# Altium project Task Tyler.PrjPcb (part 2 of 3)

## Sheet LED_POWER.SchDoc
size A; SheetNumber: 27; SheetTotal: 30
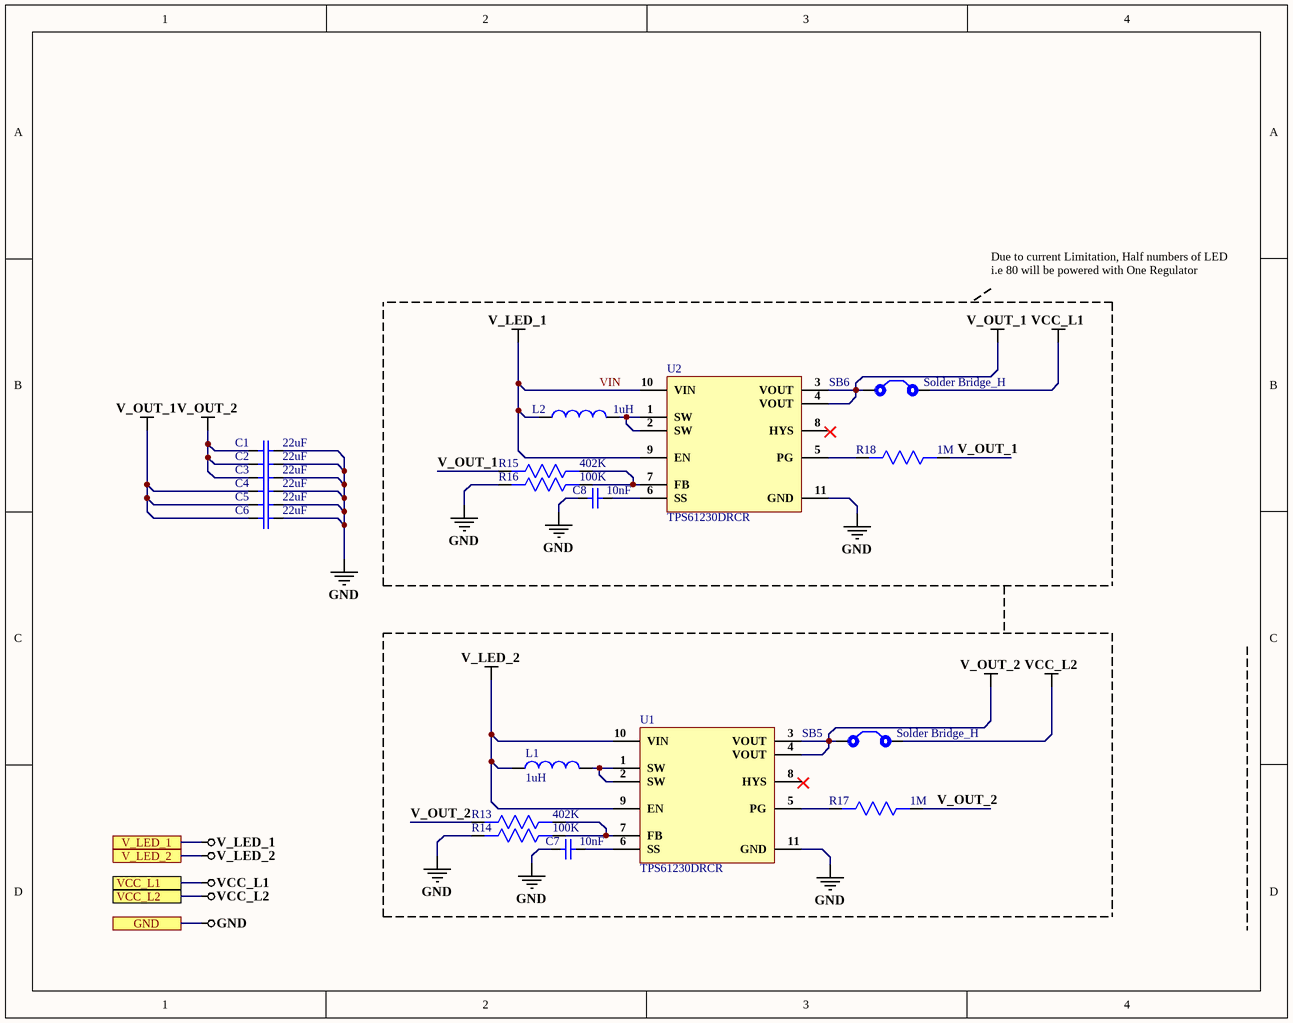
[diagram p23: LED_POWER.SchDoc]

### Parts
C1  22uF  [Cap0805]
C2  22uF  [Cap0805]
C3  22uF  [Cap0805]
C4  22uF  [Cap0805]
C5  22uF  [Cap0805]
C6  22uF  [Cap0805]
C7  10nF  [CAP 0201]
C8  10nF  [CAP 0201]
L1  1uH  [1255AY-1R0N=P3]
L2  1uH  [1255AY-1R0N=P3]
R13  402K  [Res0603]
R14  100K  [Res0402]
R15  402K  [Res0603]
R16  100K  [Res0402]
R17  1M  [Res0402]
R18  1M  [Res0402]
SB5  Solder Bridge_H  [Solder Bridge throgh hole]
SB6  Solder Bridge_H  [Solder Bridge throgh hole]
U1  TPS61230DRCR  [10-VSON (3x3)]
U2  TPS61230DRCR  [10-VSON (3x3)]

### Ports
GND, V_LED_1, V_LED_2, VCC_L1, VCC_L2

### Nets
GND: C1.1 C2.1 C3.1 C4.1 C5.1 C6.1 C7.2 C8.2 R14.2 R16.2 U1.11(GND) U2.11(GND) ; port GND
V_LED_2: L1.2 U1.9(EN) U1.10(VIN) ; port V_LED_2
V_OUT_1: C4.2 C5.2 C6.2 R15.2 R18.1 SB6.1 U2.3(VOUT) U2.4(VOUT)
V_OUT_2: C1.2 C2.2 C3.2 R13.2 R17.1 SB5.1 U1.3(VOUT) U1.4(VOUT)
VCC_L1: SB6.2 ; port VCC_L1
VCC_L2: SB5.2 ; port VCC_L2
VIN: L2.2 U2.9(EN) U2.10(VIN) ; port V_LED_1  [also labelled V_LED_1]
NetC7_1: C7.1 U1.6(SS)
NetC8_1: C8.1 U2.6(SS)
NetL1_1: L1.1 U1.1(SW) U1.2(SW)
NetL2_1: L2.1 U2.1(SW) U2.2(SW)
NetR13_1: R13.1 R14.1 U1.7(FB)
NetR15_1: R15.1 R16.1 U2.7(FB)
NetR17_2: R17.2 U1.5(PG)
NetR18_2: R18.2 U2.5(PG)

Not connected (* = marked no-connect by the designer): U1 8(HYS); U2 8(HYS)

### Notes on the sheet
- Due to current Limitation, Half numbers of LED i.e 80 will be powered with One Regulator

### Library data of the parts
C1-C6 = GRM21BR60J226ME39K: CAP CER 22UF 6.3V X5R 0805; Manufacturer: Murata; Tolerance: 20%; Supplier 1: Digi-Key; Manufacturer Part Number: GRM21BR60J226ME39K; RoHS: Yes; Category: Ceramic Capacitors; Stock 1: 70081; Pricing 1: 1=0.33000, 10=0.22500, 50=0.15020, 100=0.12770, 500=0.09012, 1000=0.07886, 2500=0.07511, 5000=0.06947 (USD); Mount: Surface Mount; Case/Package: 0805; Case Code (Metric): 2012; Case Code (Imperial): 0805; Min Operating Temperature: -55°C; Max Operating Temperature: 85°C; Package Quantity: 1; Capacitance: 22uF; Voltage Rating: 6.3V; Packaging: Tape and Reel; Voltage Rating (DC): 6.3V; Dielectric: X5R; Termination: SMD/SMT; Voltage: 6.3V; Series: GRM; Construction: Flat; Length: 2mm; Width: 0.049inch; Height: 1.25mm; Thickness: 0.053inch; Depth: 1.25mm; Radiation Hardening: No; Lead Free: Lead Free; RoHS Compliant: Yes; ComponentLink1URL: https://datasheet.ciiva.com/6270/partnumbering-e-01-6270375.pdf?src-supplier=Digi-Key; ComponentLink1Description: https://datasheet.ciiva.com/6270/partnumbering-e-01-6270375.pdf?src-supplier=Digi-Key; ComponentLink2URL: https://datasheet.ciiva.com/6270/partnumbering-e-01-6270377.pdf?src-supplier=Digi-Key; ComponentLink2Description: https://datasheet.ciiva.com/6270/partnumbering-e-01-6270377.pdf?src-supplier=Digi-Key; ComponentLink3URL: https://datasheet.ciiva.com/5413/product-5413083.pdf?src-supplier=Mouser; ComponentLink3Description: https://datasheet.ciiva.com/5413/product-5413083.pdf?src-supplier=Mouser; ComponentLink4URL: https://datasheet.ciiva.com/11607/product-11607325.pdf?src-supplier=Avnet; ComponentLink4Description: https://datasheet.ciiva.com/11607/product-11607325.pdf?src-supplier=Avnet; Supplier Part Number 1: 490-6471-1-ND
C7 C8 = GRM033R71C103KE14D: CAP CER 10000PF 16V X7R 0201; Manufacturer: Murata; Tolerance: 10%; Supplier 1: Digi-Key; Manufacturer Part Number: GRM033R71C103KE14D; RoHS: Yes; Category: Ceramic Capacitors; Stock 1: 12651; Pricing 1: 1=0.10000, 10=0.01700, 50=0.00920, 100=0.00750, 500=0.00540, 1000=0.00424, 2500=0.00385, 5000=0.00354 (USD); Voltage Rating (DC): 16V; Dielectric: X7R; Capacitance: 10nF; Length: 600um; Width: 300um; Thickness: 300um; RoHS Compliant: Yes; ComponentLink1URL: http://www.farnell.com/datasheets/2867848.pdf?src-supplier=Farnell; ComponentLink1Description: http://www.farnell.com/datasheets/2867848.pdf?src-supplier=Farnell; ComponentLink2URL: http://search.murata.co.jp/Ceramy/image/img/A01X/G101/ENG/GRM033R71C103KE14-01.pdf?src-supplier=Digi-Key; ComponentLink2Description: http://search.murata.co.jp/Ceramy/image/img/A01X/G101/ENG/GRM033R71C103KE14-01.pdf?src-supplier=Digi-Key; ComponentLink3URL: http://www.farnell.com/datasheets/2867848.pdf?src-supplier=Newark; ComponentLink3Description: http://www.farnell.com/datasheets/2867848.pdf?src-supplier=Newark; ComponentLink4URL: http://www.farnell.com/datasheets/2722745.pdf?src-supplier=Element14; ComponentLink4Description: http://www.farnell.com/datasheets/2722745.pdf?src-supplier=Element14; Supplier Part Number 1: 490-14453-1-ND
L1 L2 = 1255AY-1R0N=P3: FIXED IND 1UH 6.5A 10 MOHM SMD; Manufacturer: Murata; Core Material: Ferrite; Current Rating: 9.5A; Shielding: Shielded; DC Resistance (DCR): 12mR; Test Frequency: 100kHz; Tolerance: 30%; Supplier 1: Digi-Key; Manufacturer Part Number: 1255AY-1R0N=P3; RoHS: Yes; Category: Fixed Inductors; Stock 1: 492; Pricing 1: 1=0.42000, 10=0.36800, 25=0.34120, 50=0.28880, 100=0.26250, 250=0.24676, 500=0.22050 (USD); Mount: Surface Mount; Case/Package: Nonstandard; Packaging: Tape and Reel; Resistor Type: Wirewound; Inductance: 1uH; Max DC Current: 6.5A; Length: 0.248inch; Width: 0.248inch; Height - Seated (Max): 0.177inch; RoHS Compliant: Yes; ComponentLink1URL: http://www.farnell.com/datasheets/2616880.pdf?src-supplier=Farnell; ComponentLink1Description: http://www.farnell.com/datasheets/2616880.pdf?src-supplier=Farnell; ComponentLink2URL: http://search.murata.co.jp/Ceramy/image/img/P02/J(E)TE243B-0037_DG6045C_reference.pdf?src-supplier=Digi-Key; ComponentLink2Description: http://search.murata.co.jp/Ceramy/image/img/P02/J(E)TE243B-0037_DG6045C_reference.pdf?src-supplier=Digi-Key; ComponentLink3URL: http://www.toko.co.jp/products/pdf/inductors/dg6045c.pdf?src-supplier=Digi-Key; ComponentLink3Description: http://www.toko.co.jp/products/pdf/inductors/dg6045c.pdf?src-supplier=Digi-Key; ComponentLink4URL: http://www.toko.co.jp/products/pdf/inductors/dg6045c.pdf?src-supplier=Avnet; ComponentLink4Description: http://www.toko.co.jp/products/pdf/inductors/dg6045c.pdf?src-supplier=Avnet; Supplier Part Number 1: 490-10803-1-ND
R13 R15 = RK73H1JTTD4023F: RES 402K OHM 1% 1/10W 0603; Manufacturer: KOA Speer; Resistance: 402kR; Power Rating: 100mW; Voltage Rating: 50V; Temperature Coefficient: 100ppm/°C; Supplier 1: Digi-Key; Manufacturer Part Number: RK73H1JTTD4023F; RoHS: Yes; Category: Chip SMD Resistors; Stock 1: 50000; Pricing 1: 1=0.10000, 10=0.02200, 100=0.00910, 1000=0.00408, 2500=0.00354 (USD); Case/Package: 0603; Case Code (Imperial): 0603; Case Code (Metric): 1608; Min Operating Temperature: -55°C; Max Operating Temperature: 155°C; Tolerance: 1%; Packaging: Tape and Reel; Resistor Type: Thick Film; Termination: SMD/SMT; Voltage Rating (DC): 50V; Series: RK73H; Construction: Rectangular; Length: 1.6mm; Depth: 0.8mm; Military Standard: Not; Lead Free: Lead Free; RoHS Compliant: Yes; ComponentLink1URL: https://datasheet.ciiva.com/5553/rk73h-5553241.pdf?src-supplier=Mouser; ComponentLink1Description: https://datasheet.ciiva.com/5553/rk73h-5553241.pdf?src-supplier=Mouser; Supplier Part Number 1: 2019-RK73H1JTTD4023FCT-ND
R14 R16 = RK73H1ETTP1003F: RES 100K OHM 1% 1/10W 0402; Manufacturer: KOA Speer; Manufacturer Series: RK73H; Voltage Rating: 50V; Resistance: 100kR; Power Rating: 63mW; Temperature Coefficient: 100ppm/°C; Additional Feature: PRECISION; Supplier 1: Digi-Key; Manufacturer Part Number: RK73H1ETTP1003F; RoHS: Yes; Category: Chip SMD Resistors; Stock 1: 373472; Pricing 1: 1=0.10000, 10=0.02400, 100=0.00970, 1000=0.00437, 2500=0.00380, 5000=0.00314 (USD); Case/Package: 0402; Case Code (Imperial): 0402; Case Code (Metric): 1005; Package Shape: Rectangular; Size Code: 0402; Terminal Finish: Tin; Min Operating Temperature: -55°C; Max Operating Temperature: 155°C; Packaging: Tape and Reel; Package Quantity: 10000; Tolerance: 1%; Resistor Type: Thick Film; Termination: SMD/SMT; Working Voltage: 50V; Voltage Rating (DC): 50V; Series: RK73H; Technology: METAL GLAZE/THICK FILM; Construction: Rectangular; Length: 1mm; Width: 0.5mm; Height: 0.35mm; Depth: 0.5mm; Military Standard: Not; Lead Free: Lead Free; RoHS Compliant: Yes; ComponentLink1URL: http://www.mouser.com/ds/2/219/RK73H-5715.pdf?src-supplier=Mouser; ComponentLink1Description: http://www.mouser.com/ds/2/219/RK73H-5715.pdf?src-supplier=Mouser; ComponentLink2URL: http://www.jameco.com/Jameco/Products/ProdDS/1882455.pdf?src-supplier=Jameco; ComponentLink2Description: http://www.jameco.com/Jameco/Products/ProdDS/1882455.pdf?src-supplier=Jameco; ComponentLink3URL: http://components.arrow.com/part/dataview/39721605S6492599N5146?src-supplier=Arrow+Electronics; ComponentLink3Description: http://components.arrow.com/part/dataview/39721605S6492599N5146?src-supplier=Arrow+Electronics; ComponentLink4URL: https://www.verical.com/server-webapp/html/getDatasheet?partID=26325&src-supplier=Verical; ComponentLink4Description: https://www.verical.com/server-webapp/html/getDatasheet?partID=26325&src-supplier=Verical; Supplier Part Number 1: 2019-RK73H1ETTP1003FCT-ND
R17 R18 = RK73G1ETTP1004F: RES 1M OHM 1% 1/10W 0402; Manufacturer: KOA Speer; Resistance: 4R; Supplier 1: Digi-Key; Manufacturer Part Number: RK73G1ETTP1004F; RoHS: Yes; Category: Chip SMD Resistors; Stock 1: 8474; Pricing 1: 1=0.29000, 10=0.24200, 100=0.09460, 1000=0.03960, 2500=0.03630, 5000=0.03300 (USD); Case/Package: 0402; Case Code (Imperial): 0402; Case Code (Metric): 1005; Packaging: Tape and Reel; Package Quantity: 10000; Termination: SMD/SMT; Series: RK73G; Length: 1mm; Width: 0.5mm; Height: 0.35mm; RoHS Compliant: Yes; ComponentLink1URL: http://www.mouser.com/ds/2/219/RK73G-9863.pdf?src-supplier=Mouser; ComponentLink1Description: http://www.mouser.com/ds/2/219/RK73G-9863.pdf?src-supplier=Mouser; Supplier Part Number 1: 2019-RK73G1ETTP1004FCT-ND
SB5 SB6 = Solder Bridge Trough hole: Solder Bridge ON
U1 U2 = TPS61230DRCR: IC REG BOOST ADJ 4A 10VSON; Manufacturer: Texas Instruments; Number of Outputs: 1; Output Voltage: 5.5V; Max Output Current: 2.1A; Min Input Voltage: 2.3V; Efficiency: 96%; Min Output Voltage: 2.5V; Switching Frequency: 2MHz; Synchronous Rectifier: Yes; Quiescent Current: 35uA; Output Type: Adjustable; Output Configuration: Positive; Supplier 1: Digi-Key; Manufacturer Part Number: TPS61230DRCR; RoHS: Yes; Category: Power Supply Modules; Stock 1: 42459; Pricing 1: 1=2.61000, 10=2.34800, 25=2.21520, 100=1.77230, 250=1.55080, 500=1.50648, 1000=1.19632 (USD); Number of Pins: 10; Weight: 0.001058oz; Contact Plating: Gold; Min Operating Temperature: -40°C; Max Operating Temperature: 85°C; Max Input Voltage: 5.5V; Packaging: Tape and Reel; Max Output Voltage: 5.5V; Output Current: 2.1A; Package Quantity: 3000; Topology: Boost; Operating Supply Voltage: 5.5V; Length: 3.1mm; Width: 3.1mm; Height: 0.95mm; Radiation Hardening: No; REACH SVHC: No SVHC; Lead Free: Lead Free; RoHS Compliant: Yes; ComponentLink1URL: https://datasheet.ciiva.com/48475/tps61230-48475574.pdf?src-supplier=Avnet; ComponentLink1Description: https://datasheet.ciiva.com/48475/tps61230-48475574.pdf?src-supplier=Avnet; Supplier Part Number 1: 296-37761-1-ND

## Sheet POWER_SWITCH.SchDoc
size A; SheetNumber: 29; SheetTotal: 30
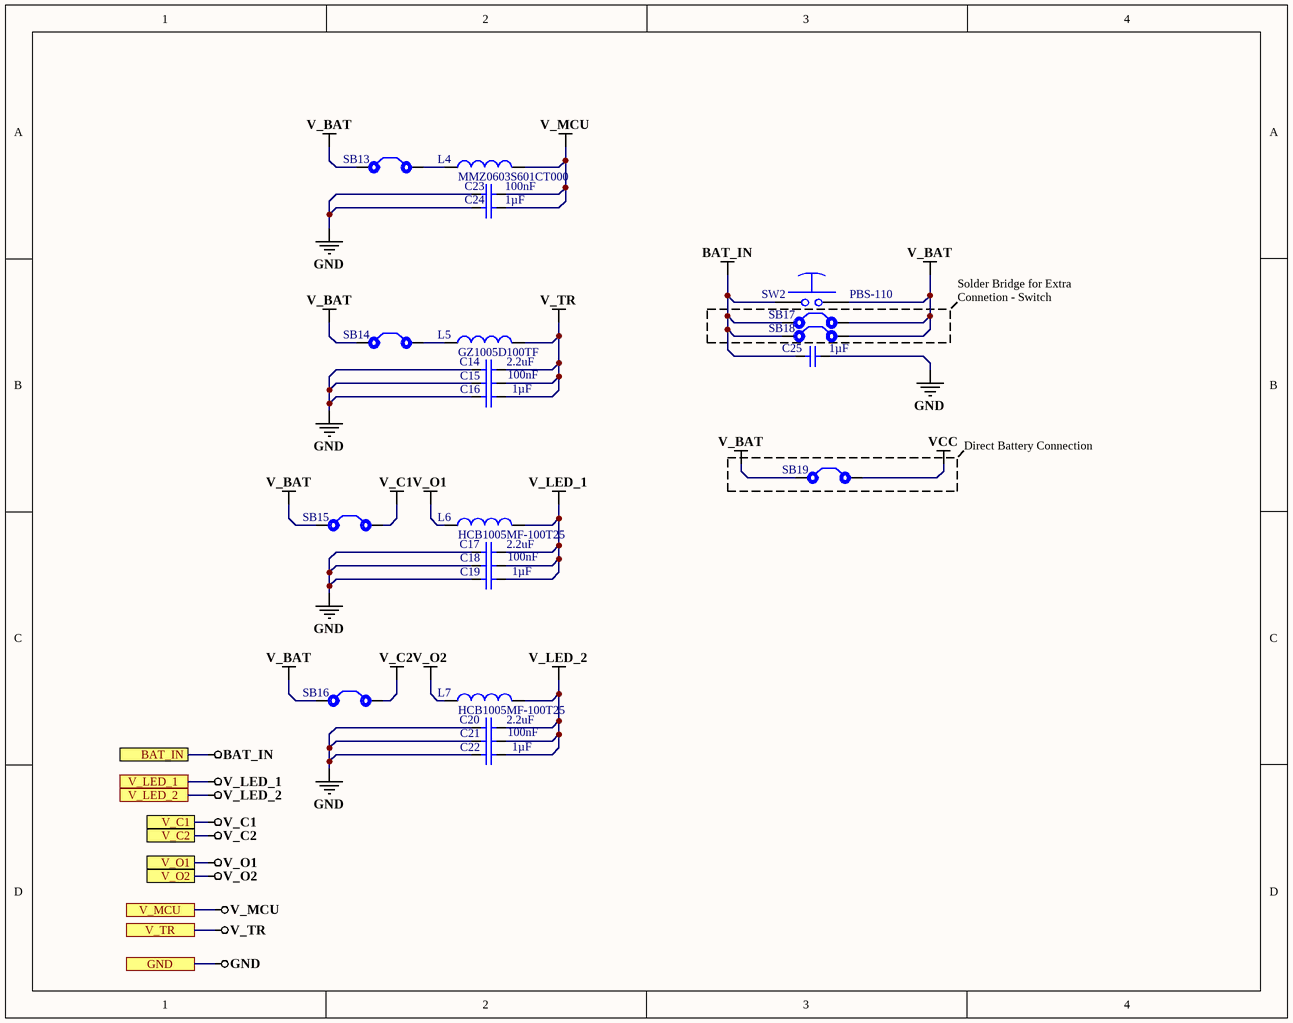
[diagram p24: POWER_SWITCH.SchDoc]

### Parts
C14  2.2uF  [Cap0402]
C15  100nF  [Cap0402]
C16  1µF  [Cap0402]
C17  2.2uF  [Cap0402]
C18  100nF  [Cap0402]
C19  1µF  [Cap0402]
C20  2.2uF  [Cap0402]
C21  100nF  [Cap0402]
C22  1µF  [Cap0402]
C23  100nF  [Cap0402]
C24  1µF  [Cap0402]
C25  1µF  [Cap0402]
L4  MMZ0603S601CT000  [IND 0201]
L5  GZ1005D100TF  [IND 0402 (1005 Metric)]
L6  HCB1005MF-100T25  [HCB1005MF-100T25]
L7  HCB1005MF-100T25  [HCB1005MF-100T25]
SB13  Solder Bridge  [Solder Bridge]  (value not drawn)
SB14  Solder Bridge  [Solder Bridge]  (value not drawn)
SB15  Solder Bridge  [Solder Bridge]  (value not drawn)
SB16  Solder Bridge  [Solder Bridge]  (value not drawn)
SB17  Solder Bridge  [Solder Bridge]  (value not drawn)
SB18  Solder Bridge  [Solder Bridge]  (value not drawn)
SB19  Solder Bridge  [Solder Bridge]  (value not drawn)
SW2  PBS-110  [PBS-110]

### Ports
BAT_IN, GND, V_C1, V_C2, V_LED_1, V_LED_2, V_MCU, V_O1, V_O2, V_TR

### Nets
BAT_IN: C25.2 SB17.1 SB18.1 SW2.1 ; port BAT_IN
GND: C14.2 C15.2 C16.2 C17.2 C18.2 C19.2 C20.2 C21.2 C22.2 C23.2 C24.2 C25.1 ; port GND
V_BAT: SB13.1 SB14.1 SB15.1 SB16.1 SB17.2 SB18.2 SB19.1 SW2.2
V_C1: SB15.2 ; port V_C1
V_C2: SB16.2 ; port V_C2
V_LED_1: C17.1 C18.1 C19.1 L6.2 ; port V_LED_1  [project net VIN]
V_LED_2: C20.1 C21.1 C22.1 L7.2 ; port V_LED_2
V_MCU: C23.1 C24.1 L4.2 ; port V_MCU
V_O1: L6.1 ; port V_O1
V_O2: L7.1 ; port V_O2
V_TR: C14.1 C15.1 C16.1 L5.2 ; port V_TR
VCC: SB19.2
NetL4_1: L4.1 SB13.2
NetL5_1: L5.1 SB14.2

### Notes on the sheet
- Solder Bridge for Extra Connetion - Switch
- Direct Battery Connection

### Library data of the parts
C14 C17 C20 = CL05A225KA5NUNC: CAP CER 2.2UF 25V X5R 0402; Manufacturer: Samsung; Tolerance: 10%; Supplier 1: Digi-Key; Manufacturer Part Number: CL05A225KA5NUNC; RoHS: Yes; Category: Ceramic Capacitors; Stock 1: 10124; Pricing 1: 1=0.35000, 10=0.23700, 50=0.15820, 100=0.13440, 500=0.09488, 1000=0.08302, 2500=0.07907, 5000=0.07314 (USD); Mount: Surface Mount; Case/Package: 0402; Case Code (Metric): 1005; Case Code (Imperial): 0402; Min Operating Temperature: -55°C; Max Operating Temperature: 85°C; Package Quantity: 1; Packaging: Cut Tape; Capacitance: 2.2uF; Voltage Rating: 25V; Length: 0.039inch; Width: 0.02inch; Thickness: 0.022inch; ComponentLink1URL: https://datasheet.ciiva.com/25790/cl05a225ka5nunc-25790835.pdf?src-supplier=Digi-Key; ComponentLink1Description: https://datasheet.ciiva.com/25790/cl05a225ka5nunc-25790835.pdf?src-supplier=Digi-Key; Supplier Part Number 1: 1276-1460-1-ND
C15 C18 C21 C23 = CC0402KRX7R8BB104: CAP CER 0.1UF 25V X7R 0402; Manufacturer: Yageo; Tolerance: 10%; Dissipation Factor: 3.5%; Supplier 1: Digi-Key; Manufacturer Part Number: CC0402KRX7R8BB104; RoHS: Yes; Category: Ceramic Capacitors; Stock 1: 1841009; Pricing 1: 1=0.10000, 10=0.03100, 50=0.01700, 100=0.01390, 500=0.00990, 1000=0.00777, 2500=0.00707, 5000=0.00650 (USD); Mount: Surface Mount; Case/Package: 0402; Case Code (Imperial): 0402; Case Code (Metric): 1005; Min Operating Temperature: -55°C; Max Operating Temperature: 125°C; Capacitance: 100nF; Dielectric: X7R; Voltage Rating: 25V; Voltage Rating (DC): 25V; Packaging: Tape and Reel; Termination: SMD/SMT; Resistor Type: Ceramic; Length: 1mm; Width: 0.02inch; Height: 0.5mm; Thickness: 0.022inch; Depth: 0.5mm; Radiation Hardening: No; Lead Free: Lead Free; Halogen Free: Halogen Free; ComponentLink1URL: https://datasheet.ciiva.com/11464/upy-gphc-x7r-6-3v-to-50v-8-11464889.pdf?src-supplier=Avnet; ComponentLink1Description: https://datasheet.ciiva.com/11464/upy-gphc-x7r-6-3v-to-50v-8-11464889.pdf?src-supplier=Avnet; ComponentLink2URL: https://datasheet.ciiva.com/13210/upy-gphc-x7r-6-3v-to-50v-8-12304-13210908.pdf?src-supplier=Mouser; ComponentLink2Description: https://datasheet.ciiva.com/13210/upy-gphc-x7r-6-3v-to-50v-8-12304-13210908.pdf?src-supplier=Mouser; ComponentLink3URL: https://datasheet.ciiva.com/17437/upy-gphc-x7r-6-3v-to-50v-8-17437357.pdf?src-supplier=Avnet+Europe; ComponentLink3Description: https://datasheet.ciiva.com/17437/upy-gphc-x7r-6-3v-to-50v-8-17437357.pdf?src-supplier=Avnet+Europe; Supplier Part Number 1: 311-2077-1-ND
C16 C19 C22 C24 C25 = GRM155R61E105KA12D: CAP CER 1UF 25V X5R 0402; Manufacturer: Murata; Material: Ceramic; Tolerance: 10%; Supplier 1: Digi-Key; Manufacturer Part Number: GRM155R61E105KA12D; RoHS: Yes; Category: Ceramic Capacitors; Stock 1: 961231; Pricing 1: 1=0.11000, 10=0.08000, 50=0.04360, 100=0.03560, 500=0.02542, 1000=0.01997, 2500=0.01815, 5000=0.01670 (USD); Mount: Surface Mount; Case/Package: 0402; Case Code (Metric): 1005; Case Code (Imperial): 0402; Weight: 0.000212oz; Min Operating Temperature: -55°C; Max Operating Temperature: 85°C; Capacitance: 1uF; Voltage Rating: 25V; Packaging: Tape and Reel; Dielectric: X5R; Voltage: 25V; Termination: SMD/SMT; Voltage Rating (DC): 25V; Package Quantity: 10000; Series: GRM; Length: 1mm; Width: 0.5mm; Height: 0.5mm; Thickness: 0.022inch; Depth: 0.5mm; REACH SVHC: No SVHC; Lead Free: Lead Free; ComponentLink1URL: https://datasheet.ciiva.com/22732/1666664-22732122.pdf?src-supplier=Element14; ComponentLink1Description: https://datasheet.ciiva.com/22732/1666664-22732122.pdf?src-supplier=Element14; ComponentLink2URL: https://datasheet.ciiva.com/7719/1666664-7719006.pdf?src-supplier=Element14; ComponentLink2Description: https://datasheet.ciiva.com/7719/1666664-7719006.pdf?src-supplier=Element14; Supplier Part Number 1: 490-10017-1-ND
L4 = MMZ0603S601CT000: FERRITE BEAD 600 OHM 0201 1LN; Manufacturer: TDK; Impedance: 600R; Tolerance: 25%; DC Resistance (DCR): 1.45R; Max DC Current: 100mA; Supplier 1: Digi-Key; Manufacturer Part Number: MMZ0603S601CT000; RoHS: Yes; Category: Inductors; Stock 1: 1540; Pricing 1: 1=0.12000, 10=0.09900, 25=0.07680, 50=0.06380, 100=0.05500, 250=0.04400, 500=0.03960, 1000=0.03300, 5000=0.03080 (USD); Mount: Surface Mount; Case/Package: 0201; Core Material: Ferrite; Case Code (Metric): 0603; Case Code (Imperial): 0201; Packaging: Cut Tape; Package Quantity: 15000; Current Rating: 100mA; Length: 0.024inch; Width: 0.012inch; Height: 0.013inch; REACH SVHC: No SVHC; Lead Free: Lead Free; RoHS Compliant: Yes; ComponentLink1URL: https://datasheet.ciiva.com/46381/1795294-46381669.pdf?src-supplier=Element14; ComponentLink1Description: https://datasheet.ciiva.com/46381/1795294-46381669.pdf?src-supplier=Element14; ComponentLink2URL: https://datasheet.ciiva.com/46634/beads-commercial-signal-mmz-en-46634390.pdf?src-supplier=Digi-Key; ComponentLink2Description: https://datasheet.ciiva.com/46634/beads-commercial-signal-mmz-en-46634390.pdf?src-supplier=Digi-Key; ComponentLink3URL: https://datasheet.ciiva.com/48682/beads-commercial-signal-mmz-en-48682603.pdf?src-supplier=Avnet; ComponentLink3Description: https://datasheet.ciiva.com/48682/beads-commercial-signal-mmz-en-48682603.pdf?src-supplier=Avnet; ComponentLink4URL: https://datasheet.ciiva.com/46634/beads-commercial-signal-mmz-en-46634381.pdf?src-supplier=Digi-Key; ComponentLink4Description: https://datasheet.ciiva.com/46634/beads-commercial-signal-mmz-en-46634381.pdf?src-supplier=Digi-Key; Supplier Part Number 1: 445-2146-1-ND
L5 = GZ1005D100TF: 10Ω 100MHz 500mA 1 50mΩ 0402 Ferrite Beads; Manufacturer: Sunlord; Value: Custom; Manufacturer Part No: GZ1005D100TF; Package: 0402
L6 L7 = HCB1005MF-100T25: 10Ω 100MHz 2.5A 1 50mΩ 0402 Ferrite Beads; Manufacturer: TAI-TECH; Current Rating (Max): 10Ω @ 100MHz; Number of Lines: 1; Package: 0402; Current Rating (Max): 2.5A; DC Resistance (DCR) (Max): 50mΩ
SB13-SB19 = Solder Bridge: Solder Bridge ON
SW2 = PBS-110: Conn Isolated Power Socket Strip SKT 20 POS 4.19mm Solder ST Thru-Hole 20 Terminal 1 Port Tube; Switch Type: Push Button Switch; Current: 15A; Features: Momentary; Material: Plastic; Model Number: PBS-110

## Sheet SEC_POWER.SchDoc
size A; SheetNumber: 30; SheetTotal: 30
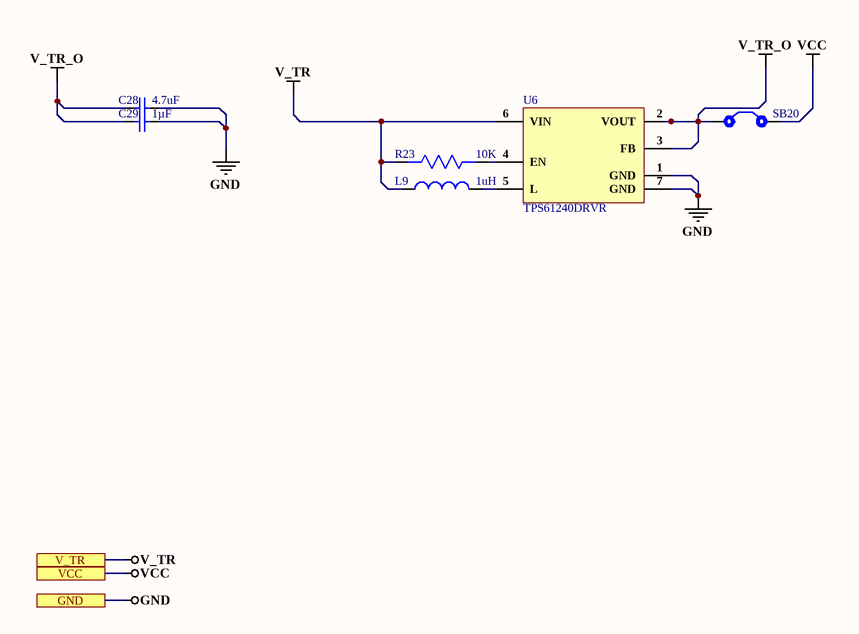
[diagram p25: SEC_POWER.SchDoc]

### Parts
C28  4.7uF  [Cap0402]
C29  1µF  [Cap0402]
L9  1uH  [IND 0603]
R23  10K  [Res-0201]
SB20  Solder Bridge  [Solder Bridge]  (value not drawn)
U6  TPS61240DRVR  [TPS61240DRVR]

### Ports
GND, V_TR, VCC

### Nets
GND: C28.1 C29.1 U6.1(GND) U6.7(GND) ; port GND
V_TR: L9.1 R23.2 U6.6(VIN) ; port V_TR
V_TR_O: C28.2 C29.2 SB20.1 U6.2(VOUT) U6.3(FB)
VCC: SB20.2 ; port VCC
NetL9_2: L9.2 U6.5(L)
NetR23_1: R23.1 U6.4(EN)

### Library data of the parts
C28 = CC0402MRX5R5BB475: CAP CER 4.7UF 6.3V X5R 0402; Manufacturer: Yageo; Tolerance: 20%; Voltage: 4V; Supplier 1: Digi-Key; Manufacturer Part Number: CC0402MRX5R5BB475; RoHS: Yes; Category: Ceramic Capacitors; Stock 1: 47905; Pricing 1: 1=0.18000, 10=0.12400, 50=0.07460, 100=0.06300, 500=0.04308, 1000=0.03810, 2500=0.03644, 5000=0.03313 (USD); Mount: Surface Mount; Case/Package: 0402; Case Code (Imperial): 0402; Case Code (Metric): 1005; Weight: 2.3E-05oz; Min Operating Temperature: -55°C; Max Operating Temperature: 85°C; Capacitance: 4.7uF; Dielectric: X5R; Voltage Rating (DC): 6.3V; Packaging: Tape and Reel; Voltage Rating: 6.3V; Termination: SMD/SMT; Resistor Type: Ceramic; Length: 1mm; Width: 0.02inch; Height: 0.5mm; Thickness: 0.022inch; Depth: 0.5mm; Radiation Hardening: No; Lead Free: Lead Free; Halogen Free: Halogen Free; ComponentLink1URL: http://components.arrow.com/part/dataview/0323_04166410?src-supplier=Arrow+Europe; ComponentLink1Description: http://components.arrow.com/part/dataview/0323_04166410?src-supplier=Arrow+Europe; ComponentLink2URL: http://www.mouser.com/ds/2/447/UPY-GPHC_X5R_4V-to-50V_25-1131599.pdf?src-supplier=Mouser; ComponentLink2Description: http://www.mouser.com/ds/2/447/UPY-GPHC_X5R_4V-to-50V_25-1131599.pdf?src-supplier=Mouser; ComponentLink3URL: http://www.yageo.com/documents/recent/UPY-GPHC_X5R_4V-to-50V_25.pdf?src-supplier=Digi-Key; ComponentLink3Description: http://www.yageo.com/documents/recent/UPY-GPHC_X5R_4V-to-50V_25.pdf?src-supplier=Digi-Key; ComponentLink4URL: http://www.yageo.com/documents/recent/UPY-GPHC_X5R_4V-to-50V_12.pdf?src-supplier=Avnet; ComponentLink4Description: http://www.yageo.com/documents/recent/UPY-GPHC_X5R_4V-to-50V_12.pdf?src-supplier=Avnet; ComponentLink5URL: http://www.yageo.com/documents/recent/UPY-GPHC_X5R_4V-to-50V_12.pdf?src-supplier=Avnet+Europe; ComponentLink5Description: http://www.yageo.com/documents/recent/UPY-GPHC_X5R_4V-to-50V_12.pdf?src-supplier=Avnet+Europe; ComponentLink6URL: http://www.yageo.com/exep/pages/download/literatures/ProductSelectionGuide%202014_Final_2.pdf?src-supplier=Digi-Key; ComponentLink6Description: http://www.yageo.com/exep/pages/download/literatures/ProductSelectionGuide%202014_Final_2.pdf?src-supplier=Digi-Key; Supplier Part Number 1: 311-1730-1-ND
C29 = GRM155R61E105KA12D: as C16 on sheet POWER_SWITCH; Supplier 1: Digi-Key; Manufacturer Part Number: GRM155R61E105KA12D; RoHS: Yes; Category: Ceramic Capacitors; Stock 1: 961231; Pricing 1: 1=0.11000, 10=0.08000, 50=0.04360, 100=0.03560, 500=0.02542, 1000=0.01997, 2500=0.01815, 5000=0.01670 (USD); Mount: Surface Mount; Case/Package: 0402; Case Code (Metric): 1005; Case Code (Imperial): 0402; Weight: 0.000212oz; Min Operating Temperature: -55°C; Max Operating Temperature: 85°C; Capacitance: 1uF; Voltage Rating: 25V; Packaging: Tape and Reel; Dielectric: X5R; Voltage: 25V; Termination: SMD/SMT; Voltage Rating (DC): 25V; Package Quantity: 10000; Series: GRM; Length: 1mm; Width: 0.5mm; Height: 0.5mm; Thickness: 0.022inch; Depth: 0.5mm; REACH SVHC: No SVHC; Lead Free: Lead Free; ComponentLink1URL: https://datasheet.ciiva.com/22732/1666664-22732122.pdf?src-supplier=Element14; ComponentLink1Description: https://datasheet.ciiva.com/22732/1666664-22732122.pdf?src-supplier=Element14; ComponentLink2URL: https://datasheet.ciiva.com/7719/1666664-7719006.pdf?src-supplier=Element14; ComponentLink2Description: https://datasheet.ciiva.com/7719/1666664-7719006.pdf?src-supplier=Element14; Supplier Part Number 1: 490-10017-1-ND
L9 = MGFL1608F1R0MT-LF: 1uH ±20% 1A 180mΩ 0603 Inductors; Manufacturer: microgate; Inductance: 1uH; Tolerance: ±20%; Rated current: 1A; Package: 0603
R23 = RC0201FR-0710KL: RES SMD 10K OHM 1% 1/20W 0201; Manufacturer: Yageo; Temperature Coefficient: 200ppm/°C; Resistance: 10kR; Max Power Dissipation: 50mW; Working Voltage: 25V; Supplier 1: Digi-Key; Manufacturer Part Number: RC0201FR-0710KL; RoHS: Yes; Category: Chip SMD Resistors; Stock 1: 6892350; Pricing 1: 1=0.10000, 10=0.03600, 100=0.01480, 1000=0.00665, 2500=0.00577, 5000=0.00477 (USD); Case/Package: 0201; Number of Pins: 2; Contact Plating: Tin,Matte; Weight: 6E-06oz; Case Code (Imperial): 0201; Case Code (Metric): 0603; Min Operating Temperature: -55°C; Max Operating Temperature: 125°C; Resistor Type: Thick Film; Tolerance: 1%; Features: Moisture Resistant; Termination: SMD/SMT; Number of Terminations: 2; Power Rating: 50mW; Voltage Rating: 25V; Packaging: Tape and Reel; Package Quantity: 1; Voltage Rating (DC): 25V; Length: 0.6mm; Width: 0.3mm; Height: 0.01inch; Depth: 0.3mm; Radiation Hardening: No; REACH SVHC: No SVHC; Military Standard: Not; Lead Free: Lead Free; ComponentLink1URL: https://datasheet.ciiva.com/2467/pyu-r-int-thick-7-2467109.pdf?src-supplier=Digi-Key; ComponentLink1Description: https://datasheet.ciiva.com/2467/pyu-r-int-thick-7-2467109.pdf?src-supplier=Digi-Key; ComponentLink2URL: https://datasheet.ciiva.com/2467/pyu-r-int-thick-7-2467110.pdf?src-supplier=Digi-Key; ComponentLink2Description: https://datasheet.ciiva.com/2467/pyu-r-int-thick-7-2467110.pdf?src-supplier=Digi-Key; ComponentLink3URL: https://datasheet.ciiva.com/2467/pyu-r-int-thick-7-2467111.pdf?src-supplier=Digi-Key; ComponentLink3Description: https://datasheet.ciiva.com/2467/pyu-r-int-thick-7-2467111.pdf?src-supplier=Digi-Key; ComponentLink4URL: https://datasheet.ciiva.com/7660/1421516-7660807.pdf?src-supplier=Element14; ComponentLink4Description: https://datasheet.ciiva.com/7660/1421516-7660807.pdf?src-supplier=Element14; ComponentLink5URL: https://datasheet.ciiva.com/8891/pyu-rc0201-51-rohs-l-8-8891384.pdf?src-supplier=Avnet; ComponentLink5Description: https://datasheet.ciiva.com/8891/pyu-rc0201-51-rohs-l-8-8891384.pdf?src-supplier=Avnet; ComponentLink6URL: https://datasheet.ciiva.com/28405/pyu-rc0201-51-rohs-l-8-28405609.pdf?src-supplier=Avnet+Europe; ComponentLink6Description: https://datasheet.ciiva.com/28405/pyu-rc0201-51-rohs-l-8-28405609.pdf?src-supplier=Avnet+Europe; ComponentLink7URL: https://datasheet.ciiva.com/26829/getdatasheetpartid-421074-26829851.pdf?src-supplier=Verical; ComponentLink7Description: https://datasheet.ciiva.com/26829/getdatasheetpartid-421074-26829851.pdf?src-supplier=Verical; ComponentLink8URL: https://datasheet.ciiva.com/46391/1421516-46391339.pdf?src-supplier=Element14; ComponentLink8Description: https://datasheet.ciiva.com/46391/1421516-46391339.pdf?src-supplier=Element14; ComponentLink9URL: https://datasheet.ciiva.com/16855/pyu-rc0201-51-rohs-l-8-16855789.pdf?src-supplier=Avnet+Europe; ComponentLink9Description: https://datasheet.ciiva.com/16855/pyu-rc0201-51-rohs-l-8-16855789.pdf?src-supplier=Avnet+Europe; Supplier Part Number 1: 311-10.0KMCT-ND
SB20 = Solder Bridge: Solder Bridge ON
U6 = TPS61240DRVR: IC REG BOOST SYNC 5V 0.45A 6SON; Manufacturer: Texas Instruments; Number of Outputs: 1; Max Output Current: 450mA; Efficiency: 90%; Switching Frequency: 3.5MHz; Nominal Supply Current: 200uA; Min Supply Voltage: 2.3V; Max Input Voltage: 5.5V; Synchronous Rectifier: Yes; Quiescent Current: 30uA; Output Type: Fixed; Output Configuration: Positive; Supplier 1: Digi-Key; Manufacturer Part Number: TPS61240DRVR; RoHS: Yes; Category: Voltage Regulators - Switching; Stock 1: 697; Pricing 1: 1=1.16000, 10=1.03800, 25=0.98560, 100=0.75680, 250=0.66880, 500=0.63360, 1000=0.49280 (USD); Number of Pins: 6; Weight: 0.000342oz; Contact Plating: Gold; Min Operating Temperature: -40°C; Max Operating Temperature: 85°C; Packaging: Tape and Reel; Output Voltage: 5V; Output Current: 450mA; Package Quantity: 3000; Min Input Voltage: 2.3V; Min Output Voltage: 5V; Max Output Voltage: 5V; Topology: Boost; Operating Supply Voltage: 5.5V; Radiation Hardening: No; Lead Free: Lead Free; ComponentLink1URL: https://datasheet.ciiva.com/2034/tps61240-2034192.pdf?src-supplier=Digi-Key; ComponentLink1Description: https://datasheet.ciiva.com/2034/tps61240-2034192.pdf?src-supplier=Digi-Key; Supplier Part Number 1: 296-39437-1-ND

## Sheet LED_POWER 2.SchDoc
size A
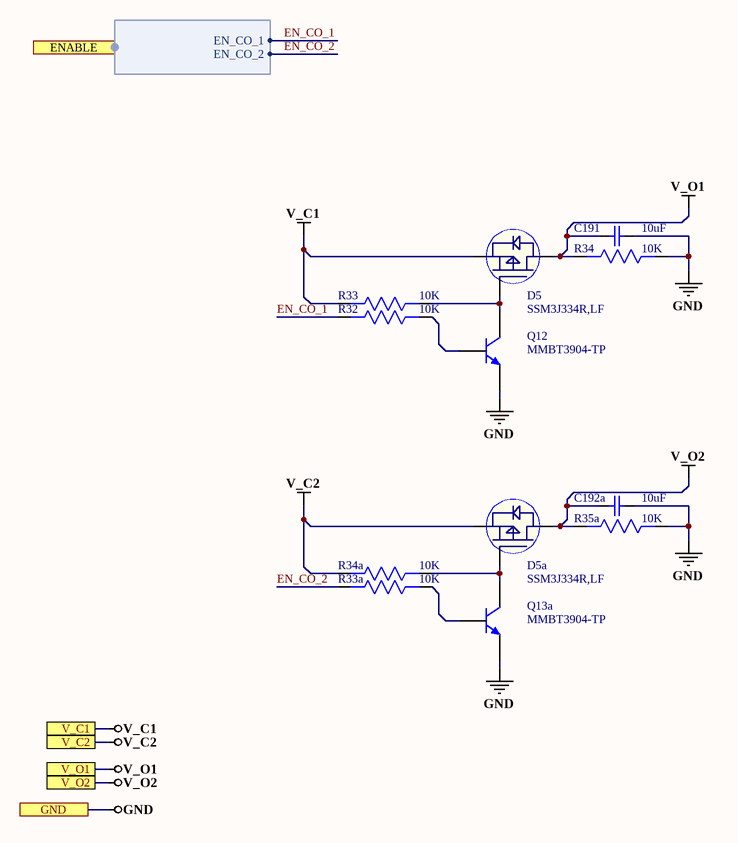
[diagram p26: LED_POWER 2.SchDoc]

### Parts
C191  10uF  [Cap0603]
C192a  10uF  [Cap0603]
D5  SSM3J334R,LF  [SOT-23F]
D5a  SSM3J334R,LF  [SOT-23F]
Q12  MMBT3904-TP  [SOT-23F]
Q13a  MMBT3904-TP  [SOT-23F]
R32  10K  [Res-0201]
R33  10K  [Res-0201]
R33a  10K  [Res-0201]
R34  10K  [Res-0201]
R34a  10K  [Res-0201]
R35a  10K  [Res-0201]

### Ports
ENABLE (harness Harness_2), GND, V_C1, V_C2, V_O1, V_O2

### Harnesses
Harness_2: EN_CO_1, EN_CO_2

### Nets
GND: C191.1 C192a.1 Q12.2(E) Q13a.2(E) R34.1 R35a.1 ; port GND
V_C1: D5.2(S) R33.2 ; port V_C1
V_C2: D5a.2(S) R34a.2 ; port V_C2
V_O1: C191.2 D5.3(D) R34.2 ; port V_O1
V_O2: C192a.2 D5a.3(D) R35a.2 ; port V_O2
EN_CO_1: R32.2 ; port ENABLE.EN_CO_1
EN_CO_2: R33a.2 ; port ENABLE.EN_CO_2
NetD5_1: D5.1(G) Q12.3(C) R33.1
NetD5a_1: D5a.1(G) Q13a.3(C) R34a.1
NetQ12_1: Q12.1(B) R32.1
NetQ13a_1: Q13a.1(B) R33a.1

### Library data of the parts
C191 C192a = GRM188R61E106KA73D: CAP CER 10UF 25V X5R 0603; Manufacturer: Murata; Supplier 1: Mouser; Manufacturer Part Number: GRM188R61E106KA73D; RoHS: Yes; Category: Ceramic Capacitors; Stock 1: 319428; Pricing 1: 1=0.36000, 10=0.25800, 50=0.25800, 100=0.15500, 1000=0.09800, 10000=0.06900 (USD); Case/Package: 0603; RoHS Compliant: Yes; ComponentLink1URL: https://search.murata.co.jp/Ceramy/image/img/A01X/G101/ENG/GRM188R61E106KA73-01.pdf?src-supplier=Digi-Key; ComponentLink1Description: https://search.murata.co.jp/Ceramy/image/img/A01X/G101/ENG/GRM188R61E106KA73-01.pdf?src-supplier=Digi-Key; Supplier Part Number 1: 81-GRM188R61E106KA3D
D5 D5a = SSM3J334R,LF: MOSFET P-CH 30V 4A SOT23F; Manufacturer: Toshiba; Number of Elements: 1; Element Configuration: Single; Drain to Source Breakdown Voltage: -30V; Rds On Max: 71mR; Input Capacitance: 280pF; Gate to Source Voltage (Vgs): 20V; Drain to Source Resistance: 136mR; Power Dissipation: 1W; Supplier 1: Digi-Key; Manufacturer Part Number: SSM3J334R,LF; RoHS: Yes; Category: MOSFETs; Stock 1: 79343; Pricing 1: 1=0.47000, 10=0.33100, 25=0.30800, 100=0.16720, 500=0.13640, 1000=0.10120 (USD); Mount: Surface Mount; Case/Package: SOT-23-3; Number of Pins: 3; Min Operating Temperature: -55°C; Max Operating Temperature: 150°C; Packaging: Tape and Reel; Package Quantity: 1; Drain to Source Voltage (Vdss): 30V; Continuous Drain Current (ID): 4A; Max Power Dissipation: 1W; ComponentLink1URL: https://datasheet.ciiva.com/6375/ssm3j334r-datasheet-en-20140301-6375723.pdf?src-supplier=Digi-Key; ComponentLink1Description: https://datasheet.ciiva.com/6375/ssm3j334r-datasheet-en-20140301-6375723.pdf?src-supplier=Digi-Key; ComponentLink2URL: https://datasheet.ciiva.com/6373/ssm3j334r-datasheet-en-20140301-6373837.pdf?src-supplier=Digi-Key; ComponentLink2Description: https://datasheet.ciiva.com/6373/ssm3j334r-datasheet-en-20140301-6373837.pdf?src-supplier=Digi-Key; Supplier Part Number 1: SSM3J334RLFCT-ND
Q12 Q13a = MMBT3904-TP: TRANS NPN 40V 0.2A SOT23; Manufacturer: MCC; Max Power Dissipation: 350mW; Number of Elements: 1; hFE Min: 40; Frequency: 300MHz; Max Collector Current: 200mA; Collector Base Voltage (VCBO): 60V; Emitter Base Voltage (VEBO): 6V; Collector Emitter Saturation Voltage: 300mV; Element Configuration: Single; Current Rating: 100mA; Supplier 1: Digi-Key; Manufacturer Part Number: MMBT3904-TP; RoHS: Yes; Category: BJTs; Stock 1: 659192; Pricing 1: 1=0.10000, 10=0.06300, 25=0.06000, 100=0.03380, 500=0.02656, 1000=0.01844 (USD); Mount: Surface Mount; Case/Package: SOT-23; Number of Pins: 3; Min Operating Temperature: -55°C; Max Operating Temperature: 150°C; Package Quantity: 1; Collector Emitter Voltage (VCEO): 40V; Packaging: Tape and Reel; Transition Frequency: 300MHz; Collector Emitter Breakdown Voltage: 40V; Polarity: NPN; Max Breakdown Voltage: 40V; Power Dissipation: 350mW; Max Frequency: 300MHz; Gain Bandwidth Product: 300MHz; Voltage Rating (DC): 40V; Series: -; Collector-emitter Voltage-Max: 300mV; Length: 3.04mm; Width: 1.4mm; Height: 1.12mm; Radiation Hardening: No; Lead Free: Lead Free; RoHS Compliant: Yes; ComponentLink1URL: https://datasheet.ciiva.com/16291/mmbt3904sot-23-37005-16291911.pdf?src-supplier=Mouser; ComponentLink1Description: https://datasheet.ciiva.com/16291/mmbt3904sot-23-37005-16291911.pdf?src-supplier=Mouser; ComponentLink2URL: https://datasheet.ciiva.com/15139/getdatasheetpartid-251950-15139820.pdf?src-supplier=Verical; ComponentLink2Description: https://datasheet.ciiva.com/15139/getdatasheetpartid-251950-15139820.pdf?src-supplier=Verical; ComponentLink3URL: https://datasheet.ciiva.com/972/mmbt3904sot-23-972515.pdf?src-supplier=Digi-Key; ComponentLink3Description: https://datasheet.ciiva.com/972/mmbt3904sot-23-972515.pdf?src-supplier=Digi-Key; ComponentLink4URL: https://datasheet.ciiva.com/16742/mmbt3904tsot-523-16742101.pdf?src-supplier=Future+Electronics; ComponentLink4Description: https://datasheet.ciiva.com/16742/mmbt3904tsot-523-16742101.pdf?src-supplier=Future+Electronics; ComponentLink5URL: https://datasheet.ciiva.com/972/mmbt3904sot-23-972516.pdf?src-supplier=Digi-Key; ComponentLink5Description: https://datasheet.ciiva.com/972/mmbt3904sot-23-972516.pdf?src-supplier=Digi-Key; ComponentLink6URL: https://datasheet.ciiva.com/14546/70055699-14546053.pdf?src-supplier=Allied+Electronics; ComponentLink6Description: https://datasheet.ciiva.com/14546/70055699-14546053.pdf?src-supplier=Allied+Electronics; Supplier Part Number 1: MMBT3904TPMSCT-ND
R32 R33 R33a R34 R34a R35a = RC0201FR-0710KL: GENERAL 0201 11% REEL (7INCH); Manufacturer: Yageo; Temperature Coefficient: 200ppm/°C; Resistance: 10kR; Tolerance: 1%; Max Power Dissipation: 50mW; Working Voltage: 25V; Supplier 1: Digi-Key; Manufacturer Part Number: RC0201FR-0710KL; RoHS: Yes; Category: Chip SMD Resistors; Stock 1: 6892350; Pricing 1: 1=0.10000, 10=0.03600, 100=0.01480, 1000=0.00665, 2500=0.00577, 5000=0.00477 (USD); Case/Package: 0201; Number of Pins: 2; Contact Plating: Tin,Matte; Weight: 6E-06oz; Case Code (Imperial): 0201; Case Code (Metric): 0603; Min Operating Temperature: -55°C; Max Operating Temperature: 125°C; Resistor Type: Thick Film; Features: Moisture Resistant; Termination: SMD/SMT; Number of Terminations: 2; Power Rating: 50mW; Voltage Rating: 25V; Packaging: Tape and Reel; Package Quantity: 1; Voltage Rating (DC): 25V; Length: 0.6mm; Width: 0.3mm; Height: 0.01inch; Depth: 0.3mm; Radiation Hardening: No; REACH SVHC: No SVHC; Military Standard: Not; Lead Free: Lead Free; ComponentLink1URL: https://datasheet.ciiva.com/2467/pyu-r-int-thick-7-2467109.pdf?src-supplier=Digi-Key; ComponentLink1Description: https://datasheet.ciiva.com/2467/pyu-r-int-thick-7-2467109.pdf?src-supplier=Digi-Key; ComponentLink2URL: https://datasheet.ciiva.com/2467/pyu-r-int-thick-7-2467110.pdf?src-supplier=Digi-Key; ComponentLink2Description: https://datasheet.ciiva.com/2467/pyu-r-int-thick-7-2467110.pdf?src-supplier=Digi-Key; ComponentLink3URL: https://datasheet.ciiva.com/2467/pyu-r-int-thick-7-2467111.pdf?src-supplier=Digi-Key; ComponentLink3Description: https://datasheet.ciiva.com/2467/pyu-r-int-thick-7-2467111.pdf?src-supplier=Digi-Key; ComponentLink4URL: https://datasheet.ciiva.com/7660/1421516-7660807.pdf?src-supplier=Element14; ComponentLink4Description: https://datasheet.ciiva.com/7660/1421516-7660807.pdf?src-supplier=Element14; ComponentLink5URL: https://datasheet.ciiva.com/8891/pyu-rc0201-51-rohs-l-8-8891384.pdf?src-supplier=Avnet; ComponentLink5Description: https://datasheet.ciiva.com/8891/pyu-rc0201-51-rohs-l-8-8891384.pdf?src-supplier=Avnet; ComponentLink6URL: https://datasheet.ciiva.com/28405/pyu-rc0201-51-rohs-l-8-28405609.pdf?src-supplier=Avnet+Europe; ComponentLink6Description: https://datasheet.ciiva.com/28405/pyu-rc0201-51-rohs-l-8-28405609.pdf?src-supplier=Avnet+Europe; ComponentLink7URL: https://datasheet.ciiva.com/26829/getdatasheetpartid-421074-26829851.pdf?src-supplier=Verical; ComponentLink7Description: https://datasheet.ciiva.com/26829/getdatasheetpartid-421074-26829851.pdf?src-supplier=Verical; ComponentLink8URL: https://datasheet.ciiva.com/46391/1421516-46391339.pdf?src-supplier=Element14; ComponentLink8Description: https://datasheet.ciiva.com/46391/1421516-46391339.pdf?src-supplier=Element14; ComponentLink9URL: https://datasheet.ciiva.com/16855/pyu-rc0201-51-rohs-l-8-16855789.pdf?src-supplier=Avnet+Europe; ComponentLink9Description: https://datasheet.ciiva.com/16855/pyu-rc0201-51-rohs-l-8-16855789.pdf?src-supplier=Avnet+Europe; Supplier Part Number 1: 311-10.0KMCT-ND

## Sheet Controller Section.SchDoc
size A; DocumentNumber: 3; SheetNumber: 3; SheetTotal: 30
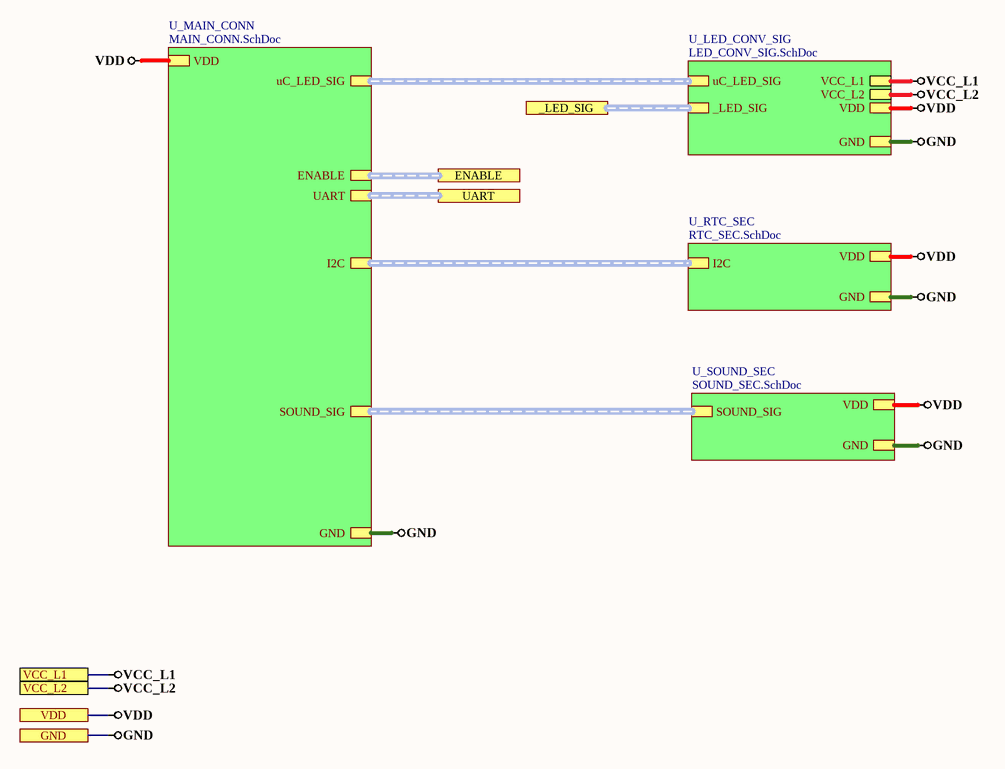
[diagram p27: Controller Section.SchDoc]

### Sub-sheets
U_LED_CONV_SIG = LED_CONV_SIG.SchDoc: GND, VDD, VCC_L1, VCC_L2, uC_LED_SIG (harness Harness_1), _LED_SIG (harness Harness_8)
U_MAIN_CONN = MAIN_CONN.SchDoc: GND, VDD, uC_LED_SIG (harness Harness_1), SOUND_SIG (harness Harness_4), UART (harness Harness), I2C (harness Harness_3), ENABLE (harness Harness_2)
U_RTC_SEC = RTC_SEC.SchDoc: VDD, GND, I2C (harness Harness_3)
U_SOUND_SEC = SOUND_SEC.SchDoc: VDD, GND, SOUND_SIG (harness Harness_4)

### Ports
_LED_SIG (harness Harness_8), ENABLE (harness Harness_2), GND, UART (harness Harness), VCC_L1, VCC_L2, VDD

### Nets
GND: port GND, sheet U_MAIN_CONN/GND, sheet U_SOUND_SEC/GND, sheet U_LED_CONV_SIG/GND, sheet U_RTC_SEC/GND
VCC_L1: port VCC_L1, sheet U_LED_CONV_SIG/VCC_L1
VCC_L2: port VCC_L2, sheet U_LED_CONV_SIG/VCC_L2
VDD: port VDD, sheet U_MAIN_CONN/VDD, sheet U_SOUND_SEC/VDD, sheet U_LED_CONV_SIG/VDD, sheet U_RTC_SEC/VDD

### Buses and harness runs
harness port _LED_SIG = sheet U_LED_CONV_SIG/_LED_SIG
harness port ENABLE = sheet U_MAIN_CONN/ENABLE
harness port UART = sheet U_MAIN_CONN/UART
harness sheet U_LED_CONV_SIG/uC_LED_SIG = sheet U_MAIN_CONN/uC_LED_SIG
harness sheet U_MAIN_CONN/I2C = sheet U_RTC_SEC/I2C
harness sheet U_MAIN_CONN/SOUND_SIG = sheet U_SOUND_SEC/SOUND_SIG

## Sheet MAIN_CONN.SchDoc
size A; SheetNumber: 5; SheetTotal: 30
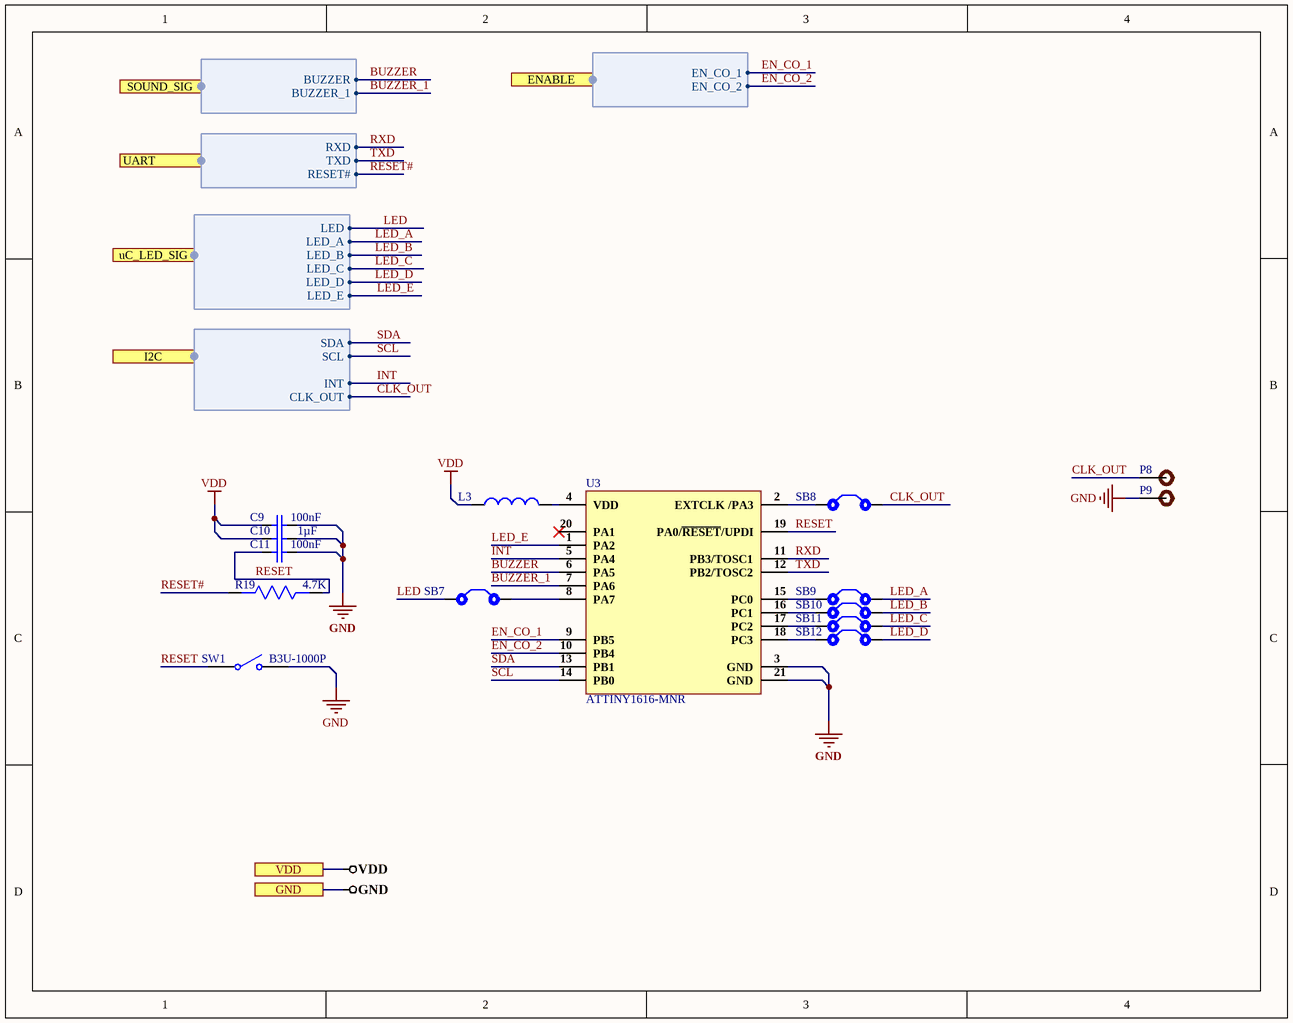
[diagram p28: MAIN_CONN.SchDoc]

### Parts
C9  100nF  [Cap0402]
C10  1µF  [Cap0402]
C11  100nF  [Cap0402]
L3  MMZ0603S601CT000  [IND 0201]  (value not drawn)
P8  Test Point  [TEST POINT]  (value not drawn)
P9  Test Point  [TEST POINT]  (value not drawn)
R19  4.7K  [Res-0201]
SB7  Solder Bridge  [Solder Bridge]  (value not drawn)
SB8  Solder Bridge  [Solder Bridge]  (value not drawn)
SB9  Solder Bridge  [Solder Bridge]  (value not drawn)
SB10  Solder Bridge  [Solder Bridge]  (value not drawn)
SB11  Solder Bridge  [Solder Bridge]  (value not drawn)
SB12  Solder Bridge  [Solder Bridge]  (value not drawn)
SW1  B3U-1000P  [B3U-1000P]
U3  ATTINY1616-MNR  [20-QFN]

### Ports
ENABLE (harness Harness_2), GND, I2C (harness Harness_3), SOUND_SIG (harness Harness_4), UART (harness Harness), uC_LED_SIG (harness Harness_1), VDD

### Harnesses
Harness: RXD, TXD, RESET#
Harness_1: LED_A, LED_B, LED_C, LED, LED_D, LED_E
Harness_2: EN_CO_1, EN_CO_2
Harness_3: SDA, SCL, INT, CLK_OUT
Harness_4: BUZZER, BUZZER_1

### Nets
GND: C9.1 C10.1 C11.1 P9.1 SW1.2 U3.3(GND) U3.21(GND) ; port GND
VDD: C9.2 C10.2 L3.1 ; port VDD
BUZZER: U3.6(PA5) ; port SOUND_SIG.BUZZER
BUZZER_1: U3.7(PA6) ; port SOUND_SIG.BUZZER_1
CLK_OUT: P8.1 SB8.2 ; port I2C.CLK_OUT
EN_CO_1: U3.9(PB5) ; port ENABLE.EN_CO_1
EN_CO_2: U3.10(PB4) ; port ENABLE.EN_CO_2
INT: U3.5(PA4) ; port I2C.INT
LED: SB7.1 ; port uC_LED_SIG.LED
LED_A: SB9.2 ; port uC_LED_SIG.LED_A
LED_B: SB10.2 ; port uC_LED_SIG.LED_B
LED_C: SB11.2 ; port uC_LED_SIG.LED_C
LED_D: SB12.2 ; port uC_LED_SIG.LED_D
LED_E: U3.1(PA2) ; port uC_LED_SIG.LED_E
RESET: C11.2 R19.1 SW1.1 U3.19(PA0/~{RESET}/UPDI)
RESET#: R19.2 ; port UART.RESET#
RXD: U3.11(PB3/TOSC1) ; port UART.RXD
SCL: U3.14(PB0) ; port I2C.SCL
SDA: U3.13(PB1) ; port I2C.SDA
TXD: U3.12(PB2/TOSC2) ; port UART.TXD
NetL3_2: L3.2 U3.4(VDD)
NetSB7_2: SB7.2 U3.8(PA7)
NetSB8_1: SB8.1 U3.2(EXTCLK_/PA3)
NetSB9_1: SB9.1 U3.15(PC0)
NetSB10_1: SB10.1 U3.16(PC1)
NetSB11_1: SB11.1 U3.17(PC2)
NetSB12_1: SB12.1 U3.18(PC3)

Not connected (* = marked no-connect by the designer): U3 20(PA1)*

### Library data of the parts
C9 C11 = CC0402KRX7R8BB104: as C15 on sheet POWER_SWITCH; Supplier 1: Digi-Key; Manufacturer Part Number: CC0402KRX7R8BB104; RoHS: Yes; Category: Ceramic Capacitors; Stock 1: 1841009; Pricing 1: 1=0.10000, 10=0.03100, 50=0.01700, 100=0.01390, 500=0.00990, 1000=0.00777, 2500=0.00707, 5000=0.00650 (USD); Mount: Surface Mount; Case/Package: 0402; Case Code (Imperial): 0402; Case Code (Metric): 1005; Min Operating Temperature: -55°C; Max Operating Temperature: 125°C; Capacitance: 100nF; Dielectric: X7R; Voltage Rating: 25V; Voltage Rating (DC): 25V; Packaging: Tape and Reel; Termination: SMD/SMT; Resistor Type: Ceramic; Length: 1mm; Width: 0.02inch; Height: 0.5mm; Thickness: 0.022inch; Depth: 0.5mm; Radiation Hardening: No; Lead Free: Lead Free; Halogen Free: Halogen Free; ComponentLink1URL: https://datasheet.ciiva.com/11464/upy-gphc-x7r-6-3v-to-50v-8-11464889.pdf?src-supplier=Avnet; ComponentLink1Description: https://datasheet.ciiva.com/11464/upy-gphc-x7r-6-3v-to-50v-8-11464889.pdf?src-supplier=Avnet; ComponentLink2URL: https://datasheet.ciiva.com/13210/upy-gphc-x7r-6-3v-to-50v-8-12304-13210908.pdf?src-supplier=Mouser; ComponentLink2Description: https://datasheet.ciiva.com/13210/upy-gphc-x7r-6-3v-to-50v-8-12304-13210908.pdf?src-supplier=Mouser; ComponentLink3URL: https://datasheet.ciiva.com/17437/upy-gphc-x7r-6-3v-to-50v-8-17437357.pdf?src-supplier=Avnet+Europe; ComponentLink3Description: https://datasheet.ciiva.com/17437/upy-gphc-x7r-6-3v-to-50v-8-17437357.pdf?src-supplier=Avnet+Europe; Supplier Part Number 1: 311-2077-1-ND
C10 = GRM155R61E105KA12D: as C16 on sheet POWER_SWITCH; Supplier 1: Digi-Key; Manufacturer Part Number: GRM155R61E105KA12D; RoHS: Yes; Category: Ceramic Capacitors; Stock 1: 961231; Pricing 1: 1=0.11000, 10=0.08000, 50=0.04360, 100=0.03560, 500=0.02542, 1000=0.01997, 2500=0.01815, 5000=0.01670 (USD); Mount: Surface Mount; Case/Package: 0402; Case Code (Metric): 1005; Case Code (Imperial): 0402; Weight: 0.000212oz; Min Operating Temperature: -55°C; Max Operating Temperature: 85°C; Capacitance: 1uF; Voltage Rating: 25V; Packaging: Tape and Reel; Dielectric: X5R; Voltage: 25V; Termination: SMD/SMT; Voltage Rating (DC): 25V; Package Quantity: 10000; Series: GRM; Length: 1mm; Width: 0.5mm; Height: 0.5mm; Thickness: 0.022inch; Depth: 0.5mm; REACH SVHC: No SVHC; Lead Free: Lead Free; ComponentLink1URL: https://datasheet.ciiva.com/22732/1666664-22732122.pdf?src-supplier=Element14; ComponentLink1Description: https://datasheet.ciiva.com/22732/1666664-22732122.pdf?src-supplier=Element14; ComponentLink2URL: https://datasheet.ciiva.com/7719/1666664-7719006.pdf?src-supplier=Element14; ComponentLink2Description: https://datasheet.ciiva.com/7719/1666664-7719006.pdf?src-supplier=Element14; Supplier Part Number 1: 490-10017-1-ND
L3 = MMZ0603S601CT000: as L4 on sheet POWER_SWITCH; Supplier 1: Digi-Key; Manufacturer Part Number: MMZ0603S601CT000; RoHS: Yes; Category: Inductors; Stock 1: 1540; Pricing 1: 1=0.12000, 10=0.09900, 25=0.07680, 50=0.06380, 100=0.05500, 250=0.04400, 500=0.03960, 1000=0.03300, 5000=0.03080 (USD); Mount: Surface Mount; Case/Package: 0201; Core Material: Ferrite; Case Code (Metric): 0603; Case Code (Imperial): 0201; Packaging: Cut Tape; Package Quantity: 15000; Current Rating: 100mA; Length: 0.024inch; Width: 0.012inch; Height: 0.013inch; REACH SVHC: No SVHC; Lead Free: Lead Free; RoHS Compliant: Yes; ComponentLink1URL: https://datasheet.ciiva.com/46381/1795294-46381669.pdf?src-supplier=Element14; ComponentLink1Description: https://datasheet.ciiva.com/46381/1795294-46381669.pdf?src-supplier=Element14; ComponentLink2URL: https://datasheet.ciiva.com/46634/beads-commercial-signal-mmz-en-46634390.pdf?src-supplier=Digi-Key; ComponentLink2Description: https://datasheet.ciiva.com/46634/beads-commercial-signal-mmz-en-46634390.pdf?src-supplier=Digi-Key; ComponentLink3URL: https://datasheet.ciiva.com/48682/beads-commercial-signal-mmz-en-48682603.pdf?src-supplier=Avnet; ComponentLink3Description: https://datasheet.ciiva.com/48682/beads-commercial-signal-mmz-en-48682603.pdf?src-supplier=Avnet; ComponentLink4URL: https://datasheet.ciiva.com/46634/beads-commercial-signal-mmz-en-46634381.pdf?src-supplier=Digi-Key; ComponentLink4Description: https://datasheet.ciiva.com/46634/beads-commercial-signal-mmz-en-46634381.pdf?src-supplier=Digi-Key; Supplier Part Number 1: 445-2146-1-ND
P8 P9 = TEST POINT: Test Point ON
R19 = RMCF0201FT4K70: RES 4.7K OHM 1% 1/20W 0201; Manufacturer: Stackpole Electronics; Max Power Dissipation: 50mW; Temperature Coefficient: 200ppm/°C; Resistance: 4.7kR; Supplier 1: Digi-Key; Manufacturer Part Number: RMCF0201FT4K70; RoHS: Yes; Category: Chip SMD Resistors; Stock 1: 325790; Pricing 1: 1=0.10000, 10=0.02300, 100=0.00940, 1000=0.00424, 2500=0.00368, 5000=0.00304 (USD); Mount: Surface Mount; Case/Package: 0201; Case Code (Metric): 0603; Contact Plating: Tin,Matte; Case Code (Imperial): 0201; Min Operating Temperature: -55°C; Max Operating Temperature: 125°C; Packaging: Tape and Reel; Tolerance: 1%; Resistor Type: Thick Film; Number of Terminations: 2; Length: 0.024inch; Width: 0.012inch; Height: 0.009inch; Radiation Hardening: No; ComponentLink1URL: https://www.seielect.com/catalog/SEI-Packaging.pdf?src-supplier=Digi-Key; ComponentLink1Description: https://www.seielect.com/catalog/SEI-Packaging.pdf?src-supplier=Digi-Key; ComponentLink2URL: https://www.seielect.com/catalog/SEI-RMCF_RMCP.pdf?src-supplier=Avnet; ComponentLink2Description: https://www.seielect.com/catalog/SEI-RMCF_RMCP.pdf?src-supplier=Avnet; Supplier Part Number 1: RMCF0201FT4K70CT-ND
SB7-SB12 = Solder Bridge: Solder Bridge ON
SW1 = B3U-1000P: SWITCH TACTILE SPST-NO 0.05A 12V; Manufacturer: Omron; Mechanical Life: 200000Cycles; Operating Force: 1.5N; Throw Configuration: SPST; Current Rating: 50mA; Contact Resistance: 100mR; Illumination Type: Non-Illuminated,Illuminated; Switch Travel: 0.15mm; Switch Function: Off-Mom; Actuator Type: Standard; Actuator Length: 0.4mm; Ratings: Dust Proof,IP40; ComponentLink1URL: http://www.farnell.com/datasheets/60838.pdf?src-supplier=Farnell; ComponentLink1Description: http://www.farnell.com/datasheets/60838.pdf?src-supplier=Farnell; ComponentLink2URL: http://www.farnell.com/datasheets/60838.pdf?src-supplier=Element14; ComponentLink2Description: http://www.farnell.com/datasheets/60838.pdf?src-supplier=Element14; ComponentLink3URL: https://omronfs.omron.com/en_US/ecb/products/pdf/en-b3u.pdf?src-supplier=Digi-Key; ComponentLink3Description: https://omronfs.omron.com/en_US/ecb/products/pdf/en-b3u.pdf?src-supplier=Digi-Key; ComponentLink4URL: http://www.omron.com/ecb/products/pdf/en-b3u.pdf?src-supplier=Digi-Key; ComponentLink4Description: http://www.omron.com/ecb/products/pdf/en-b3u.pdf?src-supplier=Digi-Key; ComponentLink5URL: https://www.distrelec.biz/Web/Downloads/he/et/B3U_eng_datasheet.pdf?mime=application%2Fpdf&src-supplier=Distrelec; ComponentLink5Description: https://www.distrelec.biz/Web/Downloads/he/et/B3U_eng_datasheet.pdf?mime=application%2Fpdf&src-supplier=Distrelec; ComponentLink6URL: http://www.onlinecomponents.com/productFiles/mf-OM/en-b3u.pdf?src-supplier=Onlinecomponents.com; ComponentLink6Description: http://www.onlinecomponents.com/productFiles/mf-OM/en-b3u.pdf?src-supplier=Onlinecomponents.com; Supplier 1: Digi-Key; Manufacturer Part Number: B3U-1000P; Stock 1: 116454; Pricing 1: 1=1, 10=0.961, 25=0.9064, 50=0.7976, 100=0.7251, 250=0.68888, 500=0.67074, 1000=0.52571 (USD); Mount: Surface Mount; Weight: 0.000776oz; Contact Material: Silver; Min Operating Temperature: -25°C; Max Operating Temperature: 70°C; Packaging: Tape and Reel; Voltage Rating (DC): 12V; Package Quantity: 1; Max Current Rating: 50mA; Termination: SMD/SMT; Orientation: Straight; Max Voltage Rating (DC): 12V; Electrical Life: 200000Cycles; Insulation Resistance: 100MR; Contact Current Rating: 50mA; Length: 4mm; Height: 1.2mm; Depth: 2.5mm; Width: 3mm; REACH SVHC: Unknown; Lead Free: Lead Free; ComponentLink7URL: https://www.verical.com/server-webapp/html/getDatasheet?partID=552554&src-supplier=Verical; ComponentLink7Description: https://www.verical.com/server-webapp/html/getDatasheet?partID=552554&src-supplier=Verical; ComponentLink8URL: http://www.farnell.com/datasheets/1685550.pdf?src-supplier=Element14; ComponentLink8Description: http://www.farnell.com/datasheets/1685550.pdf?src-supplier=Element14; ComponentLink9URL: http://www.farnell.com/datasheets/2610940.pdf?src-supplier=Farnell; ComponentLink9Description: http://www.farnell.com/datasheets/2610940.pdf?src-supplier=Farnell; ComponentLink10URL: https://www.alliedelec.com/m/d/4c8a9ef82804fc3c241a13c1e298fd73.pdf?src-supplier=Allied+Electronics; ComponentLink10Description: https://www.alliedelec.com/m/d/4c8a9ef82804fc3c241a13c1e298fd73.pdf?src-supplier=Allied+Electronics; Supplier Part Number 1: SW1020DKR-ND
U3 = ATTINY1616-MNR: IC MCU 8BIT 16KB FLASH 20VQFN; Manufacturer: Microchip; Interface: I2C,SPI,IrDA,UART,USART; Peripherals: Brown-out Detect/Reset,POR,PWM,WDT; Core Architecture: AVR; Frequency: 20MHz; Number of I/Os: 18; Oscillator Type: Internal; Supplier 1: Digi-Key; Manufacturer Part Number: ATTINY1616-MNR; RoHS: No; Category: Microcontrollers; Stock 1: 3963; Pricing 1: 1=0.75000, 25=0.69000, 100=0.62000 (USD); Case/Package: VQFN; Min Operating Temperature: -40°C; Max Operating Temperature: 105°C; Memory Type: FLASH; Packaging: Cut Tape; Memory Size: 16KB; ComponentLink1URL: http://www.microchip.com/mymicrochip/filehandler.aspx?ddocname=en606269&src-supplier=Digi-Key; ComponentLink1Description: http://www.microchip.com/mymicrochip/filehandler.aspx?ddocname=en606269&src-supplier=Digi-Key; Supplier Part Number 1: ATTINY1616-MNRCT-ND